# EAGLE design triangle (EAGLE 7.6.0)
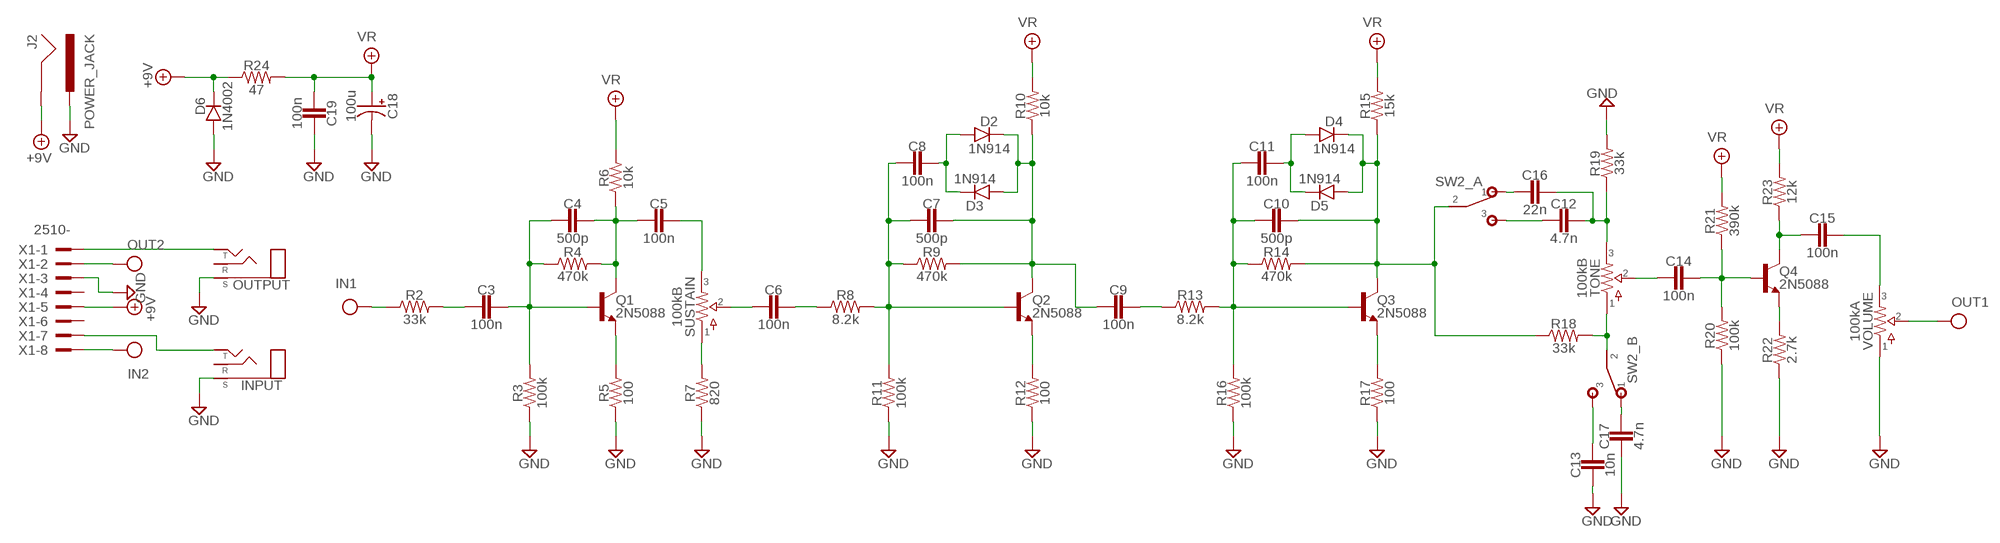
[diagram p0: schematic, sheet 1]

## Parts
C3  100n  CER/FILMBOX.1  [BOX_SMALL]
C4  500p  CER/FILM2  [050X030_025_2]
C5  100n  CER/FILMBOX.1  [BOX_SMALL]
C6  100n  CER/FILMBOX.1  [BOX_SMALL]
C7  500p  CER/FILM2  [050X030_025_2]
C8  100n  CER/FILMBOX.1  [BOX_SMALL]
C9  100n  CER/FILMBOX.1  [BOX_SMALL]
C10  500p  CER/FILM2  [050X030_025_2]
C11  100n  CER/FILMBOX.1  [BOX_SMALL]
C12  4.7n  CER/FILMBOX.1  [BOX_SMALL]
C13  10n  CER/FILMBOX.1  [BOX_SMALL]
C14  100n  CER/FILMBOX.1  [BOX_SMALL]
C15  100n  CER/FILMBOX.1  [BOX_SMALL]
C16  22n  CER/FILMBOX.1  [BOX_SMALL]
C17  4.7n  CER/FILMBOX.1  [BOX_SMALL]
C18  100u  0500  [050_020]
C19  100n  CER/FILM2  [050X030_025_2]
D2  1N914  DO35.2  [DO35-2]
D3  1N914  DO35.2  [DO35-2]
D4  1N914  DO35.2  [DO35-2]
D5  1N914  DO35.2  [DO35-2]
D6  1N4002  DO41.2  [DO41-2]
INPUT  STEREONMJ  [NMJ6HCD2]
J2  POWER_JACK  [POWER_JACK_PTH]
OUTPUT  STEREONMJ  [NMJ6HCD2]
Q1  2N5088  [TO92-]
Q2  2N5088  [TO92-]
Q3  2N5088  [TO92-]
Q4  2N5088  [TO92-]
R2  33k  R_.3B  [R0207/3]
R3  100k  R_.3B  [R0207/3]
R4  470k  R_.3B  [R0207/3]
R5  100  R_.3B  [R0207/3]
R6  10k  R_.3B  [R0207/3]
R7  820  R_.3B  [R0207/3]
R8  8.2k  R_.3B  [R0207/3]
R9  470k  R_.3B  [R0207/3]
R10  10k  R_.3B  [R0207/3]
R11  100k  R_.3B  [R0207/3]
R12  100  R_.3B  [R0207/3]
R13  8.2k  R_.3B  [R0207/3]
R14  470k  R_.3B  [R0207/3]
R15  15k  R_.3B  [R0207/3]
R16  100k  R_.3B  [R0207/3]
R17  100  R_.3B  [R0207/3]
R18  33k  R_.3B  [R0207/3]
R19  33k  R_.3B  [R0207/3]
R20  100k  R_.3B  [R0207/3]
R21  390k  R_.3B  [R0207/3]
R22  2.7k  R_.3B  [R0207/3]
R23  12k  R_.3B  [R0207/3]
R24  47  R_.3B  [R0207/3]
SUSTAIN  100kB  POTS16MM  [16MM]
SW2  DPDT  [DPDT]
TONE  100kB  POTS16MM  [16MM]
VOLUME  100kA  POTS16MM  [16MM]
X1  2510-  [PAK100/2500-10]

## Nets
+18V: D6.C J2.GND R24.1 X1.5 ; supply symbol labelled +9V
GND: C13.2 C17.2 C18.- C19.1 D6.A INPUT.S J2.PWR OUTPUT.S R3.1 R5.1 R7.1 R11.1 R12.1 R16.1 R17.1 R19.2 R20.1 R22.1 VOLUME.1 X1.3
IN: R2.1 X1.8
N$7: C3.2 R2.2
N$8: C3.1 C4.2 Q1.2(B) R3.2 R4.1
N$9: Q1.3(E) R5.2
N$10: C4.1 C5.2 Q1.1(C) R4.2 R6.1
N$11: R7.2 SUSTAIN.1
N$12: C5.1 SUSTAIN.3
N$13: C6.2 SUSTAIN.2
N$14: C6.1 R8.1
N$15: C7.2 C8.2 Q2.2(B) R8.2 R9.1 R11.2
N$16: Q2.3(E) R12.2
N$17: C9.1 R13.1
N$18: C8.1 D2.A D3.C
N$19: C7.1 C9.2 D2.C D3.A Q2.1(C) R9.2 R10.1
N$20: C10.2 C11.2 Q3.2(B) R13.2 R14.1 R16.2
N$21: Q3.3(E) R17.2
N$22: C11.1 D4.A D5.C
N$23: C10.1 D4.C D5.A Q3.1(C) R14.2 R15.1 R18.1 SW2.A2
N$24: R18.2 SW2.B2 TONE.1
N$25: C17.1 SW2.B1
N$26: C14.2 TONE.2
N$27: C14.1 Q4.2(B) R20.2 R21.1
N$28: Q4.3(E) R22.2
N$29: C15.2 Q4.1(C) R23.1
N$30: C15.1 VOLUME.3
N$31: C12.2 SW2.A3
N$32: C16.2 SW2.A1
N$33: C12.1 C16.1 R19.1 TONE.3
N$34: C13.1 SW2.B3
N$35: OUTPUT.T X1.1
N$36: INPUT.T X1.7
OUT: VOLUME.2 X1.2
VR: C18.+ C19.2 R6.2 R10.2 R15.2 R21.2 R23.2 R24.2
Unconnected: INPUT.R OUTPUT.R X1.4 X1.6

## Library data of the parts
C3-C17 C19 = pedals-capacitors-film:CER/FILM: 47 - 120pF Xicon Ceramic Disc 2.5mm lead spacing
C18 = pedals-capacitors-elec:050
D2-D5 = pedals-diodes:DO35: DO-35 Package Diodes: 1N914
D6 = pedals-diodes:DO41: DO-41 Package Diodes: 1N4001 - 1N40019 Zener Diodes: 1N4728 - 1N4764
INPUT OUTPUT = pedals-jacks:STEREO
J2 = pedals-jacks:POWER_JACK: Power Jack Connector This is the standard 5.5mm barrel jack for power. The PTH is the most common, proven, reliable, footprint. The Slot footprint only works if the mill layer is transmitted to the PCB fab house so be warned. Here are the connectors we sell at SparkFun: DC Barrel Power Jack/Connector <https://www.sparkfun.com/products/119> (PRT-00119) DC Barrel Power Jack/Connector (SMD) <https://www.sparkfun.com/products/12748> (PRT-12748) DC Barrel Jack Adapter - Breadboard Compatible <https://www.sparkfun.com/products/10811> (PRT-10811) It is used on this SparkFun product (and many, many others): SparkFun RedBoard - Programmed with Arduino <https://www.sparkfun.com/products/12757> (DEV-12757) Also, if you need a mating power supply or connector, please check these out: Wall Adapter Power Supply - 9VDC 650mA <https://www.sparkfun.com/products/298> (TOL-00298) DC Barrel Jack Adapter - Male <https://www.sparkfun.com/products/10287> (PRT-10287); PROD_ID: CONN-08197
Q1-Q4 = pedals-transistors:2N5088: NPN Transistor
R2-R24 = pedals-resistors:R_
SUSTAIN TONE VOLUME = pedals-potentiometers:POTS
SW2 = pedals-switches:DPDT
X1 = pedals-headers:2510-: 3M (TM) Pak 100 4-Wall Header Source: 3M; MF: 3M; MPN: 2510-6002UB; OC_FARNELL: 9838244; OC_NEWARK: 46F4725

## Board
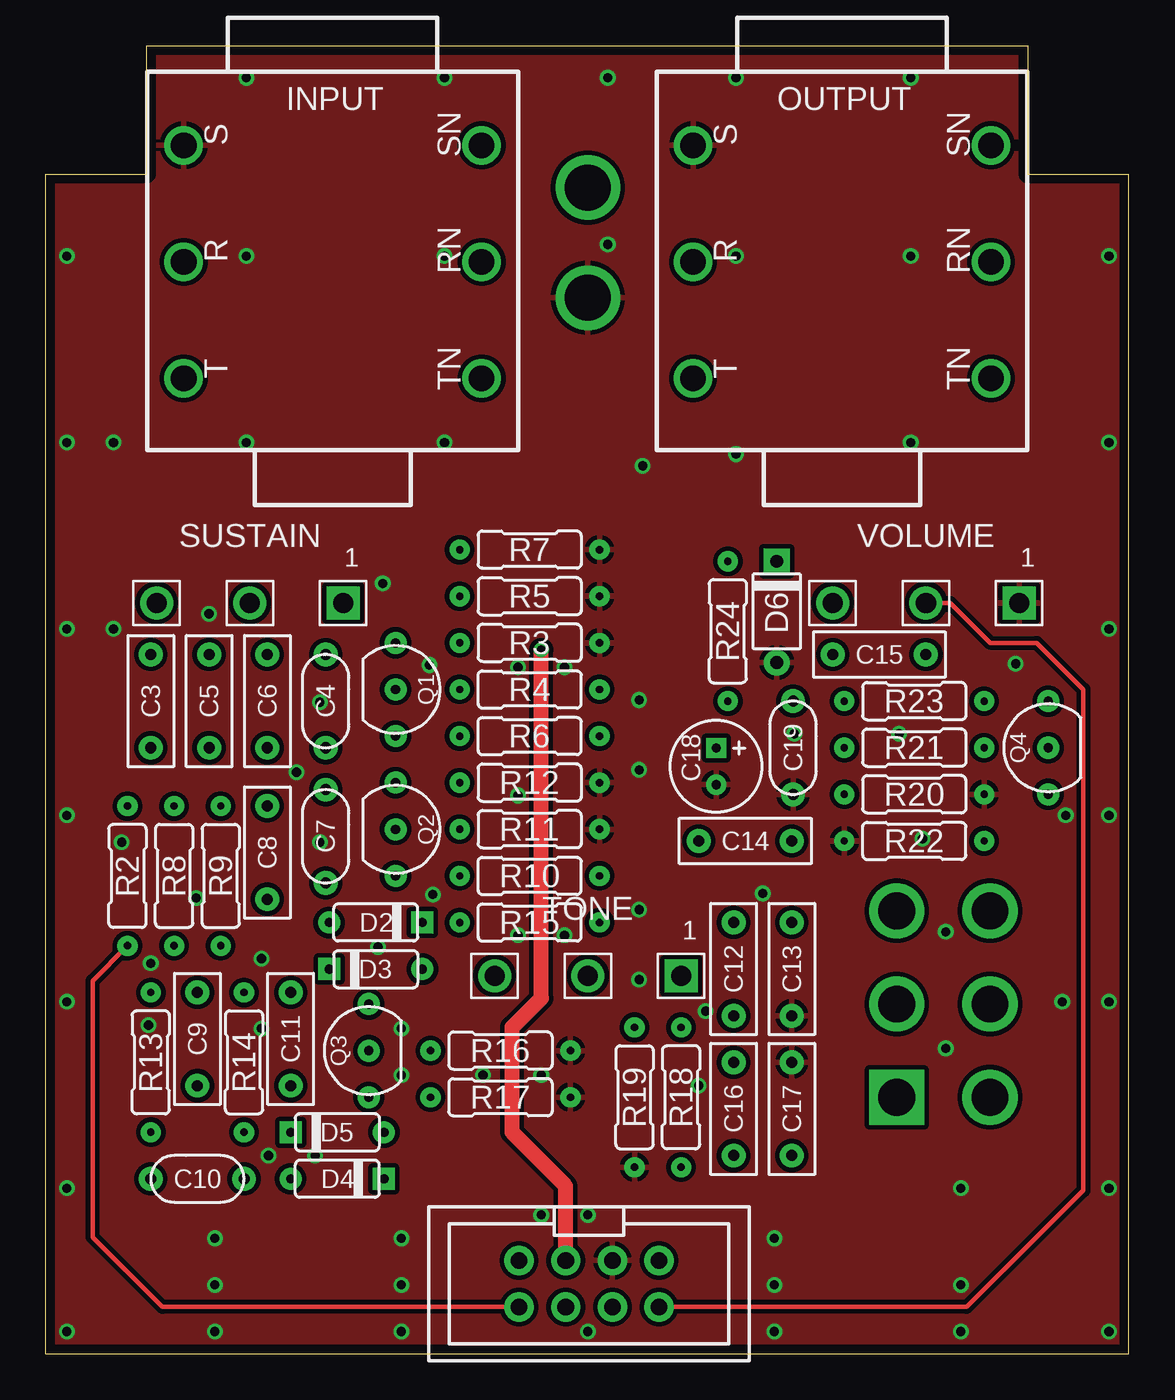
[diagram p1: board, top side]
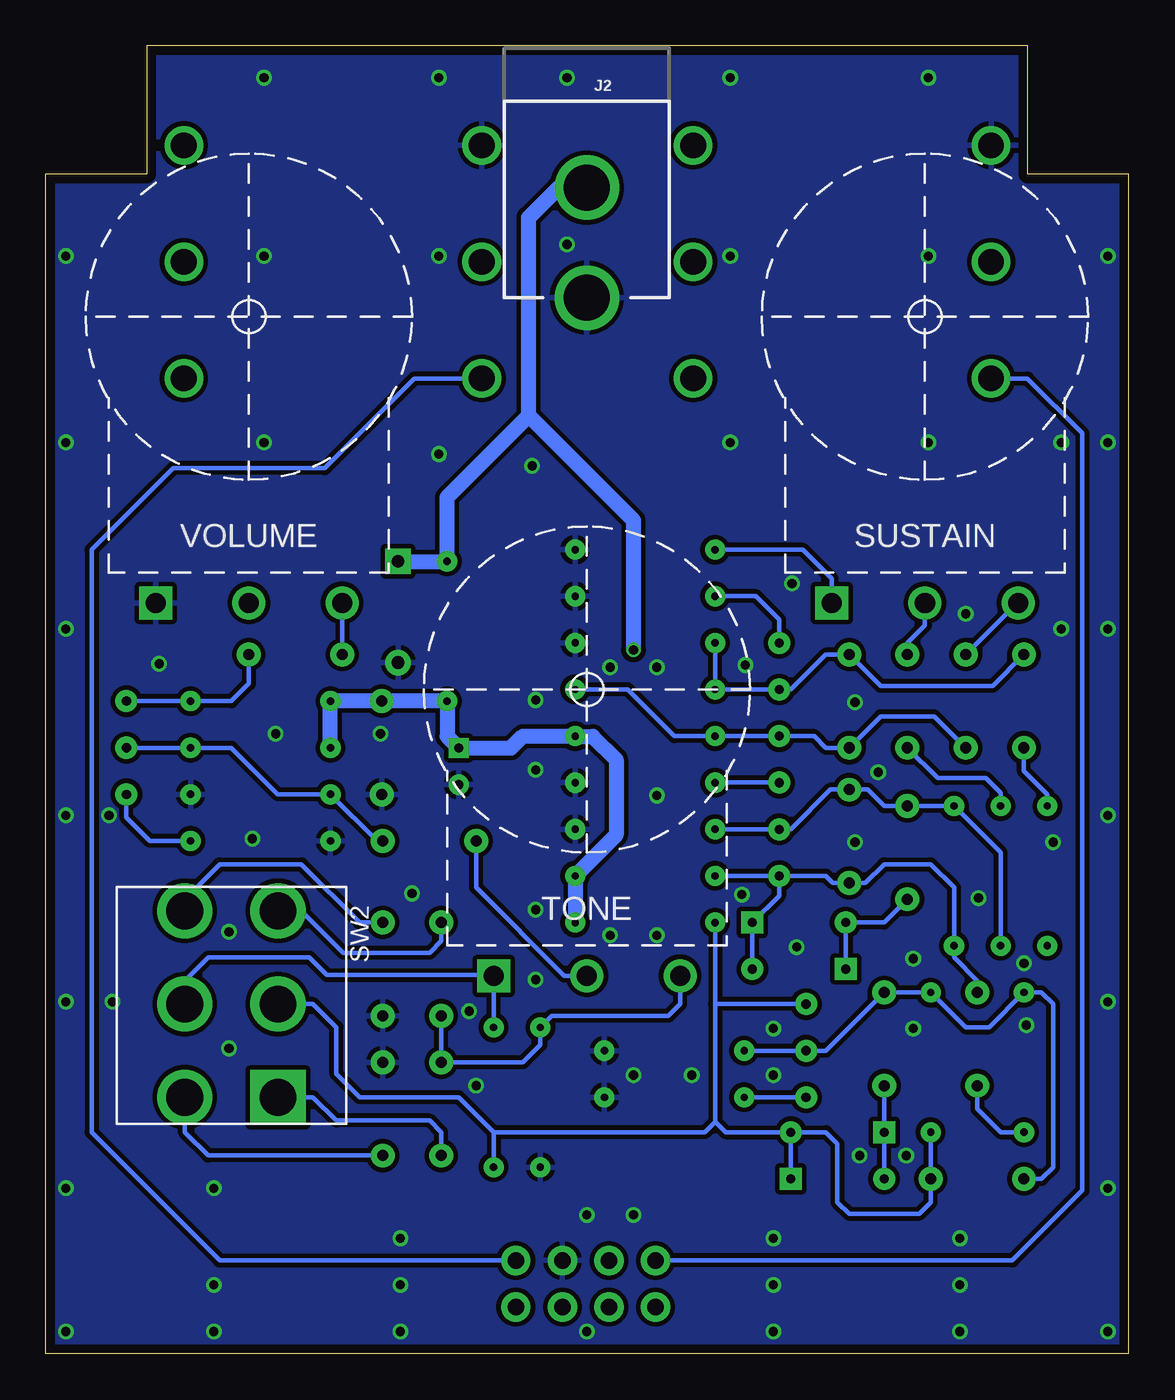
[diagram p2: board, bottom side, seen from below]

Size 59 x 71.27 mm. Coordinates in mm from the lower left corner, seen from the top.
Copper layers (1*16): Top 0.035mm / dielectric 1.6mm / Bottom 0.035mm
Design rules "Elecrow_2-layer_PCB_eagle_rule": minimum track width 6mil, minimum drill 12mil, track to track 6mil, track to pad 6mil, pad to pad 6mil, via to via 8mil, smd to smd 0mil, copper to edge 20mil, drill to drill 10mil, minimum pad ring 6mil, minimum via ring 6mil, stop-mask expansion 0mil, vias tented up to drill 100mil, thermal gap 10mil

### Footprints (pad centres in the part's own frame; a part is rotated, then mirrored left to right if it is on the bottom)
BOX_SMALL = drill 0.6 pad 1.3: 1 -2.54,0; 2 2.54,0
050X030_025_2 = drill 0.6 pad 1.3: 1 -2.54,0; 2 2.54,0
050_020 = drill 0.5 pad 1.1 square: + -0.998,0.001 | drill 0.5 pad 1.1: - 0.998,0.001
DO35-2 = drill 0.5 pad 1.2: A 2.54,0 | drill 0.5 pad 1.2 square: C -2.54,0
DO41-2 = drill 0.7 pad 1.4: A 2.794,0 | drill 0.7 pad 1.4 square: C -2.731,0
NMJ6HCD2 = drill 1.4: R 0,8.115; RN 0,-8.115; S 6.35,8.115; SN 6.35,-8.115; T -6.35,8.115; TN -6.35,-8.115
POWER_JACK_PTH = drill 2.5: GND 0,7.7; PWR 0,13.7
TO92- = drill 0.5 pad 1.2: 1 2.54,0; 2 0,0; 3 -2.54,0
R0207/3 = drill 0.4 pad 1.1: 1 -3.81,0; 2 3.81,0
16MM = drill 1.1 pad 1.8 square: 1 5.08,-1 | drill 1.1 pad 1.8: 2 0,-1; 3 -5.08,-1
DPDT = drill 2 pad 2.7 square: A1 -2.54,5.08 | drill 2 pad 2.7: A2 -2.54,0; A3 -2.54,-5.08; B1 2.54,5.08; B2 2.54,0; B3 2.54,-5.08
PAK100/2500-10 = drill 0.9 pad 1.6: 1 -3.81,-1.27; 2 -3.81,1.27; 3 -1.27,-1.27; 4 -1.27,1.27; 5 1.27,-1.27; 6 1.27,1.27; 7 3.81,-1.27; 8 3.81,1.27

### Placement (x,y rotation side)
C3  5.71,35.56 270 top
C4  15.24,35.56 90 top
C5  8.89,35.56 270 top
C6  12.06,35.56 90 top
C7  15.24,28.19 90 top
C8  12.06,27.3 90 top
C9  8.25,17.14 90 top
C10  8.25,9.53 180 top
C11  13.33,17.14 90 top
C12  37.46,20.95 90 top
C13  40.64,20.95 270 top
C14  38.1,27.94 180 top
C15  45.4,38.1 0 top
C16  37.46,13.34 270 top
C17  40.64,13.34 90 top
C18  36.51,32 270 top
C19  40.7,33.02 90 top
D2  17.97,23.5 180 top
D3  17.97,20.95 0 top
D4  15.88,9.53 180 top
D5  15.88,12.06 0 top
D6  39.81,40.45 270 top
INPUT  15.62,59.5 90 top
J2  29.53,71.25 180 bottom
OUTPUT  43.37,59.5 90 top
Q1  19.05,36.2 270 top
Q2  19.05,28.57 270 top
Q3  17.59,16.51 90 top
Q4  54.61,33.02 90 top
R2  4.44,26.04 90 top
R3  26.35,38.73 180 top
R4  26.35,36.2 0 top
R5  26.35,41.27 180 top
R6  26.35,33.66 0 top
R7  26.35,43.81 180 top
R8  6.98,26.04 270 top
R9  9.52,26.04 270 top
R10  26.35,26.04 0 top
R11  26.35,28.57 180 top
R12  26.35,31.11 180 top
R13  5.71,15.88 90 top
R14  10.79,15.88 270 top
R15  26.35,23.5 0 top
R16  24.76,16.51 180 top
R17  24.76,13.97 180 top
R18  34.61,13.97 90 top
R19  32.07,13.97 270 top
R20  47.31,30.48 180 top
R21  47.31,33.02 180 top
R22  47.31,27.94 0 top
R23  47.31,35.56 180 top
R24  37.15,39.37 270 top
SUSTAIN  11.11,41.91 0 top
SW2  48.89,19.05 180 bottom
TONE  29.53,21.59 0 top
U$1  [125B_PCB]  0,1.27 0 top
VOLUME  47.94,41.91 0 top
X1  29.59,3.81 180 top

### Tracks (layer width: path | path; a pad name or v marks a point on that pad's centre or on a via)
+18V  (via drill 0.5 pad 0.8)
  Top 0.813: v26.99,38.35 26.99,19.37 25.4,17.78 25.4,12.06 28.32,9.14 X1.5
  Bottom 0.813: D6.C R24.1 37.15,46.67 32.7,51.12 | J2.GND 31.07,63.55 32.7,61.91 32.7,51.12 | v26.99,38.35 26.99,45.4 32.7,51.12
GND  (via drill 0.5 pad 0.85)
  other vias: 57.91,59.82 57.91,49.66 10.92,69.53 21.72,69.53 30.61,69.53 1.14,49.66 10.92,59.82 10.92,49.66 21.72,59.82 21.72,49.66 30.61,60.45 37.59,69.53 47.12,69.53 37.59,59.82 47.12,59.82 57.91,39.5 57.91,29.34 57.91,19.18 57.91,9.02 57.91,1.21 49.85,1.21 39.69,1.21 29.53,1.21 19.37,1.21 9.21,1.21 1.14,1.21 1.14,59.82 1.14,39.5 1.14,29.34 1.14,19.18 1.14,9.02 47.12,49.66 37.59,49.02 32.51,48.39 9.21,3.75 19.37,3.75 39.69,3.75 49.85,3.75 9.21,6.29 19.37,6.29 39.69,6.29 29.53,7.56 26.99,7.56 23.81,15.18 5.59,17.91 5.71,21.27 11.75,21.53 11.75,17.72 26.99,15.18 28.26,22.8 25.72,22.8 25.72,37.4 28.26,37.4 25.72,30.42 14.92,27.88 14.92,35.5 4.13,27.88 3.68,39.5 49.02,16.64 49.02,22.99 47.75,28.07 46.48,33.78 32.32,20.38 32.32,24.19 32.32,31.81 32.32,35.62 18.35,41.97 55.37,19.18 55.56,29.34 52.83,37.59 3.68,49.66 18.1,22.16 49.85,9.02 39.05,25.08 8.89,40.32 13.65,31.69 19.37,15.18 19.37,17.72 14.67,10.79 12.13,10.79 40.77,33.78 20.89,37.53 8.19,24.83 21.08,25.02 35.94,18.67 35.56,14.61
  pour Top (isolate 0.254): 0,64.14 0,0 59.06,0.64 59.06,64.77 53.34,64.14 53.34,71.12 5.71,71.12 5.71,64.14
  pour Bottom (isolate 0.254): 0,0 59.06,0 59.06,71.75 0,71.75
IN
  Top 0.254: X1.8 6.35,2.54 2.54,6.35 2.54,20.32 R2.1
N$7
  Bottom 0.254: R2.2 4.44,30.48 5.71,31.75 C3.2
N$8
  Bottom 0.254: R3.2 R4.1 Q1.2 18.41,36.2 16.51,38.1 C4.2 13.53,36.39 7.43,36.39 C3.1
N$9
  Bottom 0.254: Q1.3 19.05,40.01 20.32,41.27 R5.2
N$10
  Bottom 0.254: R4.2 27.3,36.2 24.76,33.66 R6.1 Q1.1 17.14,33.66 16.51,33.02 C4.1 13.53,34.73 10.6,34.73 C5.2
N$11
  Bottom 0.254: SUSTAIN.1 16.19,42.23 17.78,43.81 R7.2
N$12
  Bottom 0.254: SUSTAIN.3 6.08,40.91 C5.1
N$13
  Bottom 0.254: SUSTAIN.2 11.11,39.69 12.06,38.73 C6.2
N$14
  Bottom 0.254: R8.1 6.98,30.54 7.81,31.37 10.41,31.37 C6.1
N$15
  Bottom 0.254: R11.2 Q2.2 18.41,28.57 16.26,30.73 C7.2 14.22,30.73 13.33,29.84 C8.2 R9.1 6.98,27.3 R8.2
N$16
  Bottom 0.254: Q2.3 R12.2
N$17
  Bottom 0.254: C9.1 8.25,13.34 6.98,12.06 R13.1
N$18
  Bottom 0.254: D3.C D2.A 13.33,23.5 C8.1
N$19
  Bottom 0.254: Q2.1 R10.1 | Q2.1 16.51,26.04 16.13,25.65 C7.1 14.35,25.65 13.33,26.67 10.79,26.67 9.52,25.4 R9.2 9.52,21.59 8.25,20.32 C9.2 | D3.A D2.C 19.05,24.96 Q2.1
N$20
  Bottom 0.254: R16.2 Q3.2 16.51,16.51 C11.2 R14.1 8.89,17.78 7.62,17.78 R13.2 4.76,19.68 4.13,19.05 4.13,10.16 4.76,9.53 C10.2
N$21
  Bottom 0.254: Q3.3 R17.2
N$22
  Bottom 0.254: C11.1 D5.C D4.A
N$23
  Bottom 0.254: SW2.A2 44.45,19.05 43.18,17.78 43.18,15.24 41.91,13.97 36.51,13.97 34.61,12.06 | R15.1 22.54,19.05 | D5.A 21.97,12.06 22.54,12.64 | Q3.1 22.54,19.05 | D5.A D4.C | R14.2 C10.1 10.79,8.26 11.43,7.62 15.24,7.62 15.88,8.26 15.88,11.43 16.51,12.06 D5.A | 22.54,19.05 22.54,12.64 | 22.54,12.64 23.11,12.06 34.61,12.06 | 34.61,12.06 R18.1
N$24
  Bottom 0.254: SW2.B2 51.43,20.32 50.16,21.59 44.64,21.59 43.69,20.64 34.65,20.64 TONE.1 R18.2
N$25
  Bottom 0.254: C17.1 50.16,10.79 51.43,12.06 SW2.B1
N$26
  Bottom 0.254: TONE.2 30.75,20.59 35.56,25.4 C14.2
N$27
  Bottom 0.254: Q4.2 R21.1 48.89,33.02 46.35,30.48 R20.2 40.96,27.94 C14.1
N$28
  Bottom 0.254: R22.2 53.34,27.94 54.61,29.21 Q4.3
N$29
  Bottom 0.254: C15.2 47.94,36.51 48.89,35.56 R23.1 Q4.1
N$30
  Bottom 0.254: VOLUME.3 C15.1
N$31
  Bottom 0.254: C12.2 37.46,22.48 38.1,21.84 42.8,21.84 45.08,24.13 SW2.A3
N$32
  Bottom 0.254: C16.2 37.46,12.06 38.1,12.7 43.18,12.7 44.45,13.97 SW2.A1
N$33
  Bottom 0.254: TONE.3 24.45,19.05 25.08,18.41 31.43,18.41 R19.1 32.07,16.83 33.02,15.88 C16.1 C12.1
N$34
  Bottom 0.254: SW2.B3 51.43,24.77 49.53,26.67 45.08,26.67 41.91,23.5 C13.1
N$35
  Bottom 0.254: X1.1 49.53,5.08 56.51,12.06 56.51,43.81 52.07,48.26 43.81,48.26 38.93,53.15 OUTPUT.T
N$36
  Bottom 0.254: X1.7 6.35,5.08 2.54,8.89 2.54,50.16 5.52,53.15 INPUT.T
OUT
  Top 0.254: VOLUME.2 49.26,40.91 51.43,38.73 53.97,38.73 56.51,36.2 56.51,8.89 50.16,2.54 X1.2
VR
  Bottom 0.813: R21.2 R23.2 C19.2 R24.2 37.15,33.64 C18.+ 33.67,33 33.02,33.66 R6.2 30.18,33.64 29.19,33.64 27.94,32.38 27.94,28.26 R10.2 R15.2